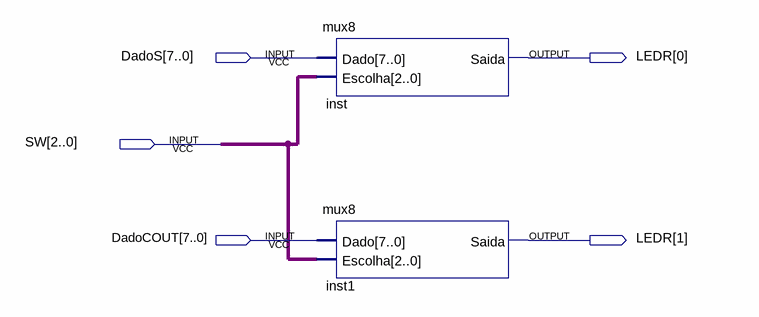
[diagram p0: schematic sheet]
// Quartus schematic Block1.bdf as structural Verilog: 2 symbols, 5 pins
module Block1 (
  input  [7:0] DadoS,
  input  [2:0] SW,
  input  [7:0] DadoCOUT,
  output [1:0] LEDR
);

  mux8 inst (.Dado(DadoS), .Escolha(SW), .Saida(LEDR[0]));
  mux8 inst1 (.Dado(DadoCOUT), .Escolha(SW), .Saida(LEDR[1]));
endmodule
